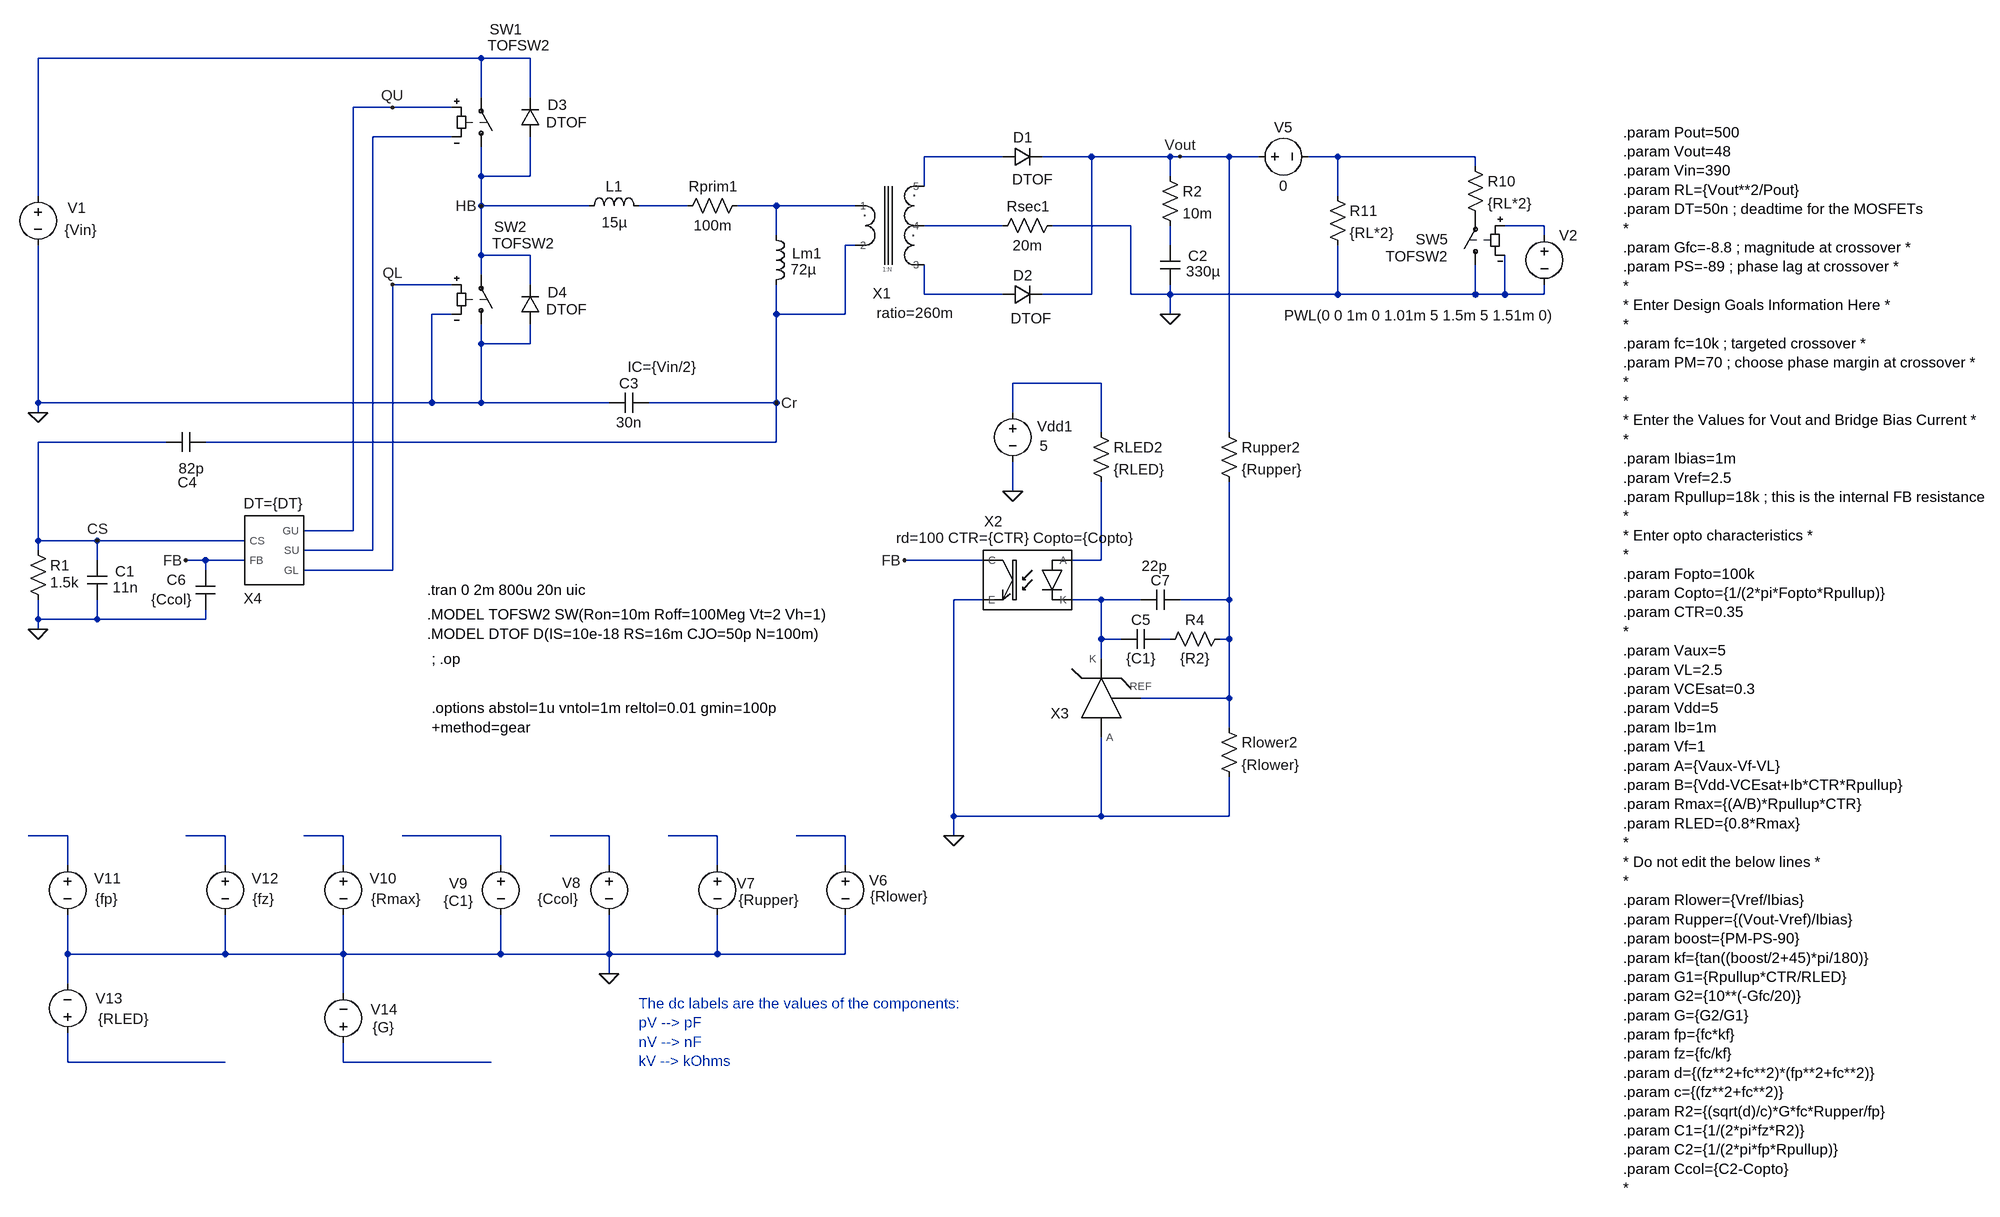
[diagram p0: schematic LLC CM - cbc - step load.asc]
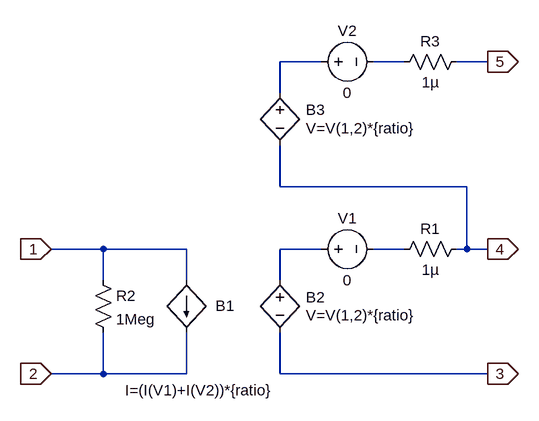
[diagram p1: sub-circuit xfmr_ctap.asc]
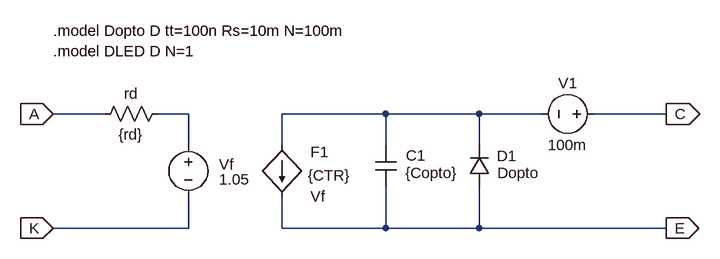
[diagram p2: sub-circuit optotof.asc]
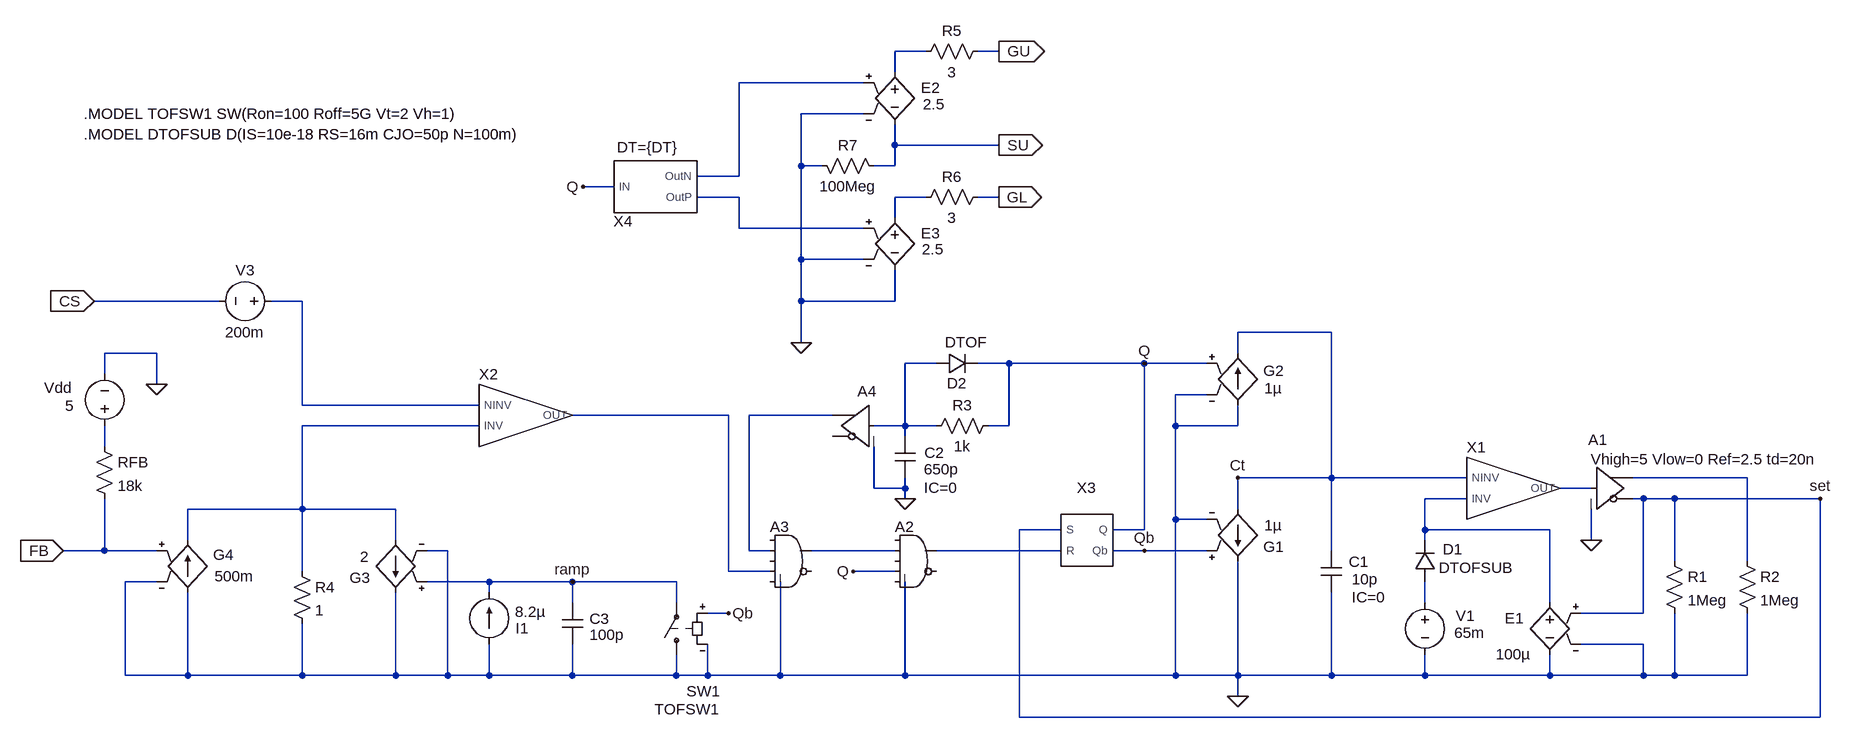
[diagram p3: sub-circuit cm_modulator_subckt.asc]
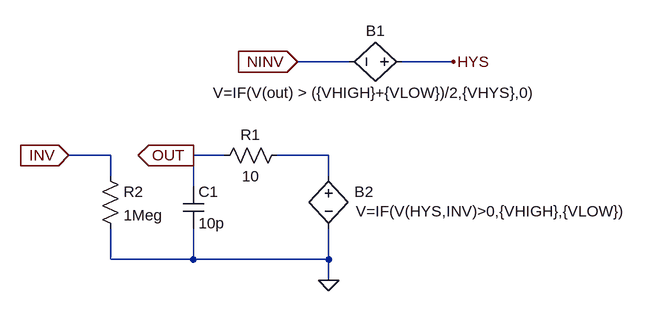
[diagram p4: sub-circuit comptof.asc]
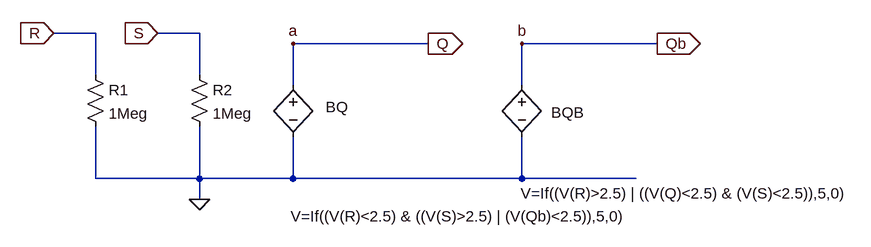
[diagram p5: sub-circuit sr_latch_llc.asc]
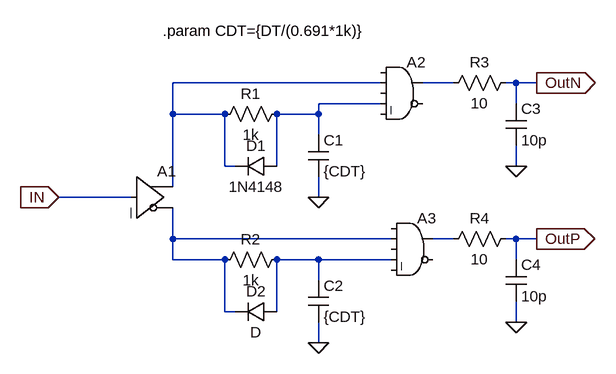
[diagram p6: sub-circuit dt_driver.asc]
LLC CM - cbc - step load.asc, the LTspice schematic file:
Version 4.1
SHEET 1 3320 1092
WIRE -1360 -1200 -2080 -1200
WIRE -1280 -1200 -1360 -1200
WIRE -1360 -1136 -1360 -1200
WIRE -1280 -1136 -1280 -1200
WIRE -1504 -1120 -1568 -1120
WIRE -1408 -1120 -1504 -1120
WIRE -1408 -1072 -1536 -1072
WIRE -512 -1040 -640 -1040
WIRE -368 -1040 -448 -1040
WIRE -240 -1040 -368 -1040
WIRE -224 -1040 -240 -1040
WIRE -144 -1040 -224 -1040
WIRE -96 -1040 -144 -1040
WIRE 32 -1040 -16 -1040
WIRE 256 -1040 32 -1040
WIRE 256 -1024 256 -1040
WIRE -1360 -1008 -1360 -1056
WIRE -1280 -1008 -1280 -1072
WIRE -1280 -1008 -1360 -1008
WIRE -240 -1008 -240 -1040
WIRE -640 -992 -640 -1040
WIRE -2080 -976 -2080 -1200
WIRE 32 -976 32 -1040
WIRE -1360 -960 -1360 -1008
WIRE -1184 -960 -1360 -960
WIRE -1024 -960 -1104 -960
WIRE -880 -960 -944 -960
WIRE -752 -960 -880 -960
WIRE -512 -928 -640 -928
WIRE -304 -928 -432 -928
WIRE 368 -928 304 -928
WIRE -880 -912 -880 -960
WIRE 368 -912 368 -928
WIRE -752 -896 -768 -896
WIRE -240 -896 -240 -928
WIRE -1360 -880 -1360 -960
WIRE -1280 -880 -1360 -880
WIRE -1360 -848 -1360 -880
WIRE -1408 -832 -1504 -832
WIRE -1280 -832 -1280 -880
WIRE -640 -816 -640 -864
WIRE -512 -816 -640 -816
WIRE -368 -816 -368 -1040
WIRE -368 -816 -448 -816
WIRE -304 -816 -304 -928
WIRE -240 -816 -240 -832
WIRE -240 -816 -304 -816
WIRE 32 -816 32 -896
WIRE 32 -816 -240 -816
WIRE 256 -816 256 -864
WIRE 256 -816 32 -816
WIRE 304 -816 304 -880
WIRE 304 -816 256 -816
WIRE 368 -816 368 -832
WIRE 368 -816 304 -816
WIRE -1408 -784 -1440 -784
WIRE -880 -784 -880 -832
WIRE -768 -784 -768 -896
WIRE -768 -784 -880 -784
WIRE -240 -784 -240 -816
WIRE -1360 -736 -1360 -768
WIRE -1280 -736 -1280 -768
WIRE -1280 -736 -1360 -736
WIRE -352 -672 -496 -672
WIRE -2080 -640 -2080 -896
WIRE -1440 -640 -1440 -784
WIRE -1440 -640 -2080 -640
WIRE -1360 -640 -1360 -736
WIRE -1360 -640 -1440 -640
WIRE -1152 -640 -1360 -640
WIRE -880 -640 -880 -784
WIRE -880 -640 -1088 -640
WIRE -2080 -624 -2080 -640
WIRE -496 -624 -496 -672
WIRE -352 -592 -352 -672
WIRE -144 -592 -144 -1040
WIRE -1872 -576 -2080 -576
WIRE -880 -576 -880 -640
WIRE -880 -576 -1808 -576
WIRE -496 -496 -496 -544
WIRE -1568 -432 -1568 -1120
WIRE -1568 -432 -1648 -432
WIRE -2080 -416 -2080 -576
WIRE -1984 -416 -2080 -416
WIRE -1744 -416 -1984 -416
WIRE -2080 -400 -2080 -416
WIRE -1536 -400 -1536 -1072
WIRE -1536 -400 -1648 -400
WIRE -1984 -384 -1984 -416
WIRE -1808 -384 -1840 -384
WIRE -1744 -384 -1808 -384
WIRE -544 -384 -672 -384
WIRE -352 -384 -352 -512
WIRE -352 -384 -400 -384
WIRE -1808 -368 -1808 -384
WIRE -1504 -368 -1504 -832
WIRE -1504 -368 -1648 -368
WIRE -544 -320 -592 -320
WIRE -352 -320 -400 -320
WIRE -288 -320 -352 -320
WIRE -144 -320 -144 -512
WIRE -144 -320 -224 -320
WIRE -2080 -288 -2080 -320
WIRE -1984 -288 -1984 -320
WIRE -1984 -288 -2080 -288
WIRE -1808 -288 -1808 -304
WIRE -1808 -288 -1984 -288
WIRE -2080 -272 -2080 -288
WIRE -352 -256 -352 -320
WIRE -320 -256 -352 -256
WIRE -240 -256 -256 -256
WIRE -144 -256 -144 -320
WIRE -144 -256 -160 -256
WIRE -352 -224 -352 -256
WIRE -144 -160 -144 -256
WIRE -144 -160 -288 -160
WIRE -144 -112 -144 -160
WIRE -592 32 -592 -320
WIRE -352 32 -352 -96
WIRE -352 32 -592 32
WIRE -144 32 -144 -32
WIRE -144 32 -352 32
WIRE -2032 64 -2096 64
WIRE -1776 64 -1840 64
WIRE -1584 64 -1648 64
WIRE -1328 64 -1488 64
WIRE -1152 64 -1248 64
WIRE -976 64 -1056 64
WIRE -768 64 -848 64
WIRE -592 64 -592 32
WIRE -2032 112 -2032 64
WIRE -1776 112 -1776 64
WIRE -1584 112 -1584 64
WIRE -1328 112 -1328 64
WIRE -1152 112 -1152 64
WIRE -976 112 -976 64
WIRE -768 112 -768 64
WIRE -2032 256 -2032 192
WIRE -1776 256 -1776 192
WIRE -1776 256 -2032 256
WIRE -1584 256 -1584 192
WIRE -1584 256 -1776 256
WIRE -1328 256 -1328 192
WIRE -1328 256 -1584 256
WIRE -1152 256 -1152 192
WIRE -1152 256 -1328 256
WIRE -976 256 -976 192
WIRE -976 256 -1152 256
WIRE -768 256 -768 192
WIRE -768 256 -976 256
WIRE -1152 288 -1152 256
WIRE -2032 304 -2032 256
WIRE -1584 320 -1584 256
WIRE -2032 432 -2032 384
WIRE -1776 432 -2032 432
WIRE -1584 432 -1584 400
WIRE -1344 432 -1584 432
FLAG -1152 288 0
FLAG -1840 -384 FB
FLAG -2080 -272 0
FLAG -240 -784 0
FLAG -224 -1040 Vout
FLAG -1360 -960 HB
FLAG -1504 -1120 QU
FLAG -1504 -832 QL
FLAG -880 -640 Cr
FLAG -2080 -624 0
FLAG -672 -384 FB
FLAG -592 64 0
FLAG -1984 -416 CS
FLAG -496 -496 0
DATAFLAG -2080 64 ""
DATAFLAG -1808 64 ""
DATAFLAG -1632 64 ""
DATAFLAG -1424 64 ""
DATAFLAG -1232 64 ""
DATAFLAG -1040 64 ""
DATAFLAG -848 64 ""
DATAFLAG -1840 432 ""
DATAFLAG -1440 432 ""
SYMBOL sw 256 -848 R180
WINDOW 3 45 30 Left 2
WINDOW 0 45 58 Left 2
SYMATTR Value TOFSW2
SYMATTR InstName SW5
SYMBOL res 240 -1040 R0
SYMATTR InstName R10
SYMATTR Value {RL*2}
SYMBOL res 16 -992 R0
SYMATTR InstName R11
SYMATTR Value {RL*2}
SYMBOL voltage 368 -928 R0
WINDOW 3 -423 146 Left 2
WINDOW 123 0 0 Left 0
WINDOW 39 0 0 Left 0
SYMATTR Value PWL(0 0 1m 0 1.01m 5 1.5m 5 1.51m 0)
SYMATTR InstName V2
SYMBOL voltage -112 -1040 R270
WINDOW 0 32 56 VTop 2
WINDOW 3 -32 56 VBottom 2
SYMATTR InstName V5
SYMATTR Value 0
SYMBOL voltage -768 96 R0
WINDOW 0 39 40 Left 2
WINDOW 3 40 66 Left 2
WINDOW 123 0 0 Left 0
WINDOW 39 0 0 Left 0
SYMATTR InstName V6
SYMATTR Value {Rlower}
SYMBOL voltage -976 96 R0
WINDOW 0 31 45 Left 2
WINDOW 3 35 72 Left 2
WINDOW 123 0 0 Left 0
WINDOW 39 0 0 Left 0
SYMATTR InstName V7
SYMATTR Value {Rupper}
SYMBOL voltage -1152 96 R0
WINDOW 0 -76 44 Left 2
WINDOW 3 -116 70 Left 2
SYMATTR InstName V8
SYMATTR Value {Ccol}
SYMBOL voltage -1328 96 R0
WINDOW 0 -84 45 Left 2
WINDOW 3 -93 73 Left 2
WINDOW 123 0 0 Left 0
WINDOW 39 0 0 Left 0
SYMATTR InstName V9
SYMATTR Value {C1}
SYMBOL voltage -1584 96 R0
WINDOW 0 43 37 Left 2
WINDOW 3 45 70 Left 2
WINDOW 123 0 0 Left 0
WINDOW 39 0 0 Left 0
SYMATTR InstName V10
SYMATTR Value {Rmax}
SYMBOL voltage -2032 96 R0
WINDOW 0 43 37 Left 2
WINDOW 3 45 70 Left 2
WINDOW 123 0 0 Left 0
WINDOW 39 0 0 Left 0
SYMATTR InstName V11
SYMATTR Value {fp}
SYMBOL voltage -1776 96 R0
WINDOW 0 43 37 Left 2
WINDOW 3 45 70 Left 2
WINDOW 123 0 0 Left 0
WINDOW 39 0 0 Left 0
SYMATTR InstName V12
SYMATTR Value {fz}
SYMBOL voltage -2032 400 M180
WINDOW 0 46 72 Left 2
WINDOW 3 50 39 Left 2
SYMATTR InstName V13
SYMATTR Value {RLED}
SYMBOL voltage -1584 416 R180
WINDOW 0 -87 70 Left 2
WINDOW 3 -83 41 Left 2
SYMATTR InstName V14
SYMATTR Value {G}
SYMBOL cap -2000 -384 R0
WINDOW 0 45 18 Left 2
WINDOW 3 41 44 Left 2
SYMATTR InstName C1
SYMATTR Value 11n
SYMBOL res -2096 -416 R0
WINDOW 3 36 68 Left 2
SYMATTR Value 1.5k
SYMATTR InstName R1
SYMBOL diode -512 -1024 R270
WINDOW 0 32 32 VTop 2
WINDOW 3 -5 48 VBottom 2
SYMATTR InstName D1
SYMATTR Value DTOF
SYMBOL diode -512 -800 R270
WINDOW 0 32 32 VTop 2
WINDOW 3 -7 46 VBottom 2
SYMATTR InstName D2
SYMATTR Value DTOF
SYMBOL res -256 -1024 R0
SYMATTR InstName R2
SYMATTR Value 10m
SYMBOL cap -256 -896 R0
WINDOW 0 45 17 Left 2
WINDOW 3 42 42 Left 2
SYMATTR InstName C2
SYMATTR Value 330µ
SYMBOL res -416 -944 R90
WINDOW 0 0 56 VBottom 2
WINDOW 3 32 56 VTop 2
SYMATTR InstName Rsec1
SYMATTR Value 20m
SYMBOL ind -896 -928 R0
WINDOW 0 42 45 Left 2
WINDOW 3 39 71 Left 2
SYMATTR InstName Lm1
SYMATTR Value 72µ
SYMBOL cap -1088 -656 R90
WINDOW 0 0 32 VBottom 2
WINDOW 3 32 32 VTop 2
WINDOW 123 -27 -21 VBottom 2
SYMATTR InstName C3
SYMATTR Value 30n
SYMATTR Value2 IC={Vin/2}
SYMBOL res -928 -976 R90
WINDOW 0 0 56 VBottom 2
WINDOW 3 32 56 VTop 2
SYMATTR InstName Rprim1
SYMATTR Value 100m
SYMBOL ind -1200 -944 R270
WINDOW 0 32 56 VTop 2
WINDOW 3 5 56 VBottom 2
SYMATTR InstName L1
SYMATTR Value 15µ
SYMBOL sw -1360 -1040 M180
WINDOW 3 11 181 Left 2
WINDOW 0 14 207 Left 2
SYMATTR Value TOFSW2
SYMATTR InstName SW1
SYMBOL sw -1360 -752 M180
WINDOW 3 18 147 Left 2
WINDOW 0 21 174 Left 2
SYMATTR Value TOFSW2
SYMATTR InstName SW2
SYMBOL voltage -2080 -992 R0
WINDOW 0 48 35 Left 2
WINDOW 3 43 71 Left 2
SYMATTR InstName V1
SYMATTR Value {Vin}
SYMBOL diode -1264 -1072 R180
WINDOW 0 -43 52 Left 2
WINDOW 3 -76 24 Left 2
SYMATTR InstName D3
SYMATTR Value DTOF
SYMBOL diode -1264 -768 R180
WINDOW 0 -43 52 Left 2
WINDOW 3 -76 24 Left 2
SYMATTR InstName D4
SYMATTR Value DTOF
SYMBOL cap -1808 -592 R90
WINDOW 0 97 30 VBottom 2
WINDOW 3 43 23 VTop 2
SYMATTR InstName C4
SYMATTR Value 82p
SYMBOL XFMR_CTap -688 -944 R0
WINDOW 0 -21 142 Bottom 2
WINDOW 39 32 173 Bottom 2
SYMATTR InstName X1
SYMATTR SpiceLine ratio=260m
SYMBOL res -160 -128 R0
SYMATTR InstName Rlower2
SYMATTR Value {Rlower}
SYMBOL res -160 -608 R0
SYMATTR InstName Rupper2
SYMATTR Value {Rupper}
SYMBOL res -368 -608 R0
SYMATTR InstName RLED2
SYMATTR Value {RLED}
SYMBOL cap -256 -272 R90
WINDOW 0 0 32 VBottom 2
WINDOW 3 32 32 VTop 2
SYMATTR InstName C5
SYMATTR Value {C1}
SYMBOL cap -1792 -368 M0
WINDOW 0 48 16 Left 2
WINDOW 3 40 47 Left 2
SYMATTR InstName C6
SYMATTR Value {Ccol}
SYMBOL res -144 -272 R90
WINDOW 0 0 56 VBottom 2
WINDOW 3 32 56 VTop 2
SYMATTR InstName R4
SYMATTR Value {R2}
SYMBOL cap -224 -336 R90
WINDOW 0 0 32 VBottom 2
WINDOW 3 -55 42 VTop 2
SYMATTR InstName C7
SYMATTR Value 22p
SYMBOL optoTOF -512 -352 M0
WINDOW 0 16 -80 Bottom 2
WINDOW 39 -16 -53 Bottom 2
SYMATTR InstName X2
SYMATTR SpiceLine rd=100 CTR={CTR} Copto={Copto}
SYMBOL TL431TOF -368 -208 R0
WINDOW 0 -52 88 Bottom 2
SYMATTR InstName X3
SYMBOL CM_modulator_subckt -1696 -400 R0
WINDOW 0 -35 93 Bottom 2
WINDOW 39 -2 -61 Bottom 2
SYMATTR InstName X4
SYMATTR SpiceLine DT={DT}
SYMBOL voltage -496 -640 R0
WINDOW 0 40 38 Left 2
WINDOW 3 44 70 Left 2
SYMATTR InstName Vdd1
SYMATTR Value 5
TEXT -1448 -336 Left 2 !.tran 0 2m 800u 20n uic
TEXT 496 -1080 Left 2 !.param Pout=500\n.param Vout=48\n.param Vin=390\n.param RL={Vout**2/Pout}\n.param DT=50n ; deadtime for the MOSFETs\n*\n.param Gfc=-8.8 ; magnitude at crossover *\n.param PS=-89 ; phase lag at crossover *\n*\n* Enter Design Goals Information Here *\n*\n.param fc=10k ; targeted crossover *\n.param PM=70 ; choose phase margin at crossover *\n*\n*\n* Enter the Values for Vout and Bridge Bias Current *\n*\n.param Ibias=1m\n.param Vref=2.5\n.param Rpullup=18k ; this is the internal FB resistance\n*\n* Enter opto characteristics *\n*\n.param Fopto=100k\n.param Copto={1/(2*pi*Fopto*Rpullup)}\n.param CTR=0.35\n*\n.param Vaux=5\n.param VL=2.5\n.param VCEsat=0.3\n.param Vdd=5\n.param Ib=1m\n.param Vf=1\n.param A={Vaux-Vf-VL}\n.param B={Vdd-VCEsat+Ib*CTR*Rpullup}\n.param Rmax={(A/B)*Rpullup*CTR}\n.param RLED={0.8*Rmax}\n*\n* Do not edit the below lines *\n*\n.param Rlower={Vref/Ibias}\n.param Rupper={(Vout-Vref)/Ibias}\n.param boost={PM-PS-90}\n.param kf={tan((boost/2+45)*pi/180)}\n.param G1={Rpullup*CTR/RLED}\n.param G2={10**(-Gfc/20)}\n.param G={G2/G1}\n.param fp={fc*kf}\n.param fz={fc/kf}\n.param d={(fz**2+fc**2)*(fp**2+fc**2)}\n.param c={(fz**2+fc**2)}\n.param R2={(sqrt(d)/c)*G*fc*Rupper/fp}\n.param C1={1/(2*pi*fz*R2)}\n.param C2={1/(2*pi*fp*Rpullup)}\n.param Ccol={C2-Copto}\n*
TEXT -1104 336 Left 2 ;The dc labels are the values of the components:\npV --> pF\nnV --> nF\nkV --> kOhms
TEXT -1448 -296 Left 2 !.MODEL TOFSW2 SW(Ron=10m Roff=100Meg Vt=2 Vh=1)\n.MODEL DTOF D(IS=10e-18 RS=16m CJO=50p N=100m)
TEXT -1440 -144 Left 2 !.options abstol=1u vntol=1m reltol=0.01 gmin=100p\n+method=gear
TEXT -1440 -224 Left 2 !; .op

xfmr_ctap.asc, the sub-circuit schematic file:
Version 4
SHEET 1 880 680
WIRE 368 -192 304 -192
WIRE 496 -192 448 -192
WIRE 624 -192 576 -192
WIRE 304 -144 304 -192
WIRE 304 0 304 -64
WIRE 592 0 304 0
WIRE 32 96 -48 96
WIRE 160 96 32 96
WIRE 368 96 304 96
WIRE 496 96 448 96
WIRE 592 96 592 0
WIRE 592 96 576 96
WIRE 624 96 592 96
WIRE 32 144 32 96
WIRE 160 144 160 96
WIRE 304 144 304 96
WIRE 32 288 32 224
WIRE 32 288 -48 288
WIRE 160 288 160 224
WIRE 160 288 32 288
WIRE 304 288 304 224
WIRE 624 288 304 288
FLAG 624 96 4
IOPIN 624 96 Out
FLAG 624 288 3
IOPIN 624 288 Out
FLAG -48 96 1
IOPIN -48 96 In
FLAG -48 288 2
IOPIN -48 288 In
FLAG 624 -192 5
IOPIN 624 -192 Out
SYMBOL bi 160 144 R0
WINDOW 0 45 39 Left 2
WINDOW 3 -94 169 Left 2
SYMATTR InstName B1
SYMATTR Value I=(I(V1)+I(V2))*{ratio}
SYMBOL bv 304 128 R0
WINDOW 0 40 42 Left 2
WINDOW 3 40 70 Left 2
SYMATTR InstName B2
SYMATTR Value V=V(1,2)*{ratio}
SYMBOL voltage 352 96 R270
WINDOW 0 32 56 VTop 2
WINDOW 3 -32 56 VBottom 2
WINDOW 123 0 0 Left 0
WINDOW 39 0 0 Left 0
SYMATTR InstName V1
SYMATTR Value 0
SYMBOL res 592 80 R90
WINDOW 0 0 56 VBottom 2
WINDOW 3 32 56 VTop 2
SYMATTR InstName R1
SYMATTR Value 1µ
SYMBOL res 16 128 R0
SYMATTR InstName R2
SYMATTR Value 1Meg
SYMBOL bv 304 -160 R0
WINDOW 0 40 42 Left 2
WINDOW 3 40 70 Left 2
SYMATTR InstName B3
SYMATTR Value V=V(1,2)*{ratio}
SYMBOL voltage 352 -192 R270
WINDOW 0 32 56 VTop 2
WINDOW 3 -32 56 VBottom 2
WINDOW 123 0 0 Left 0
WINDOW 39 0 0 Left 0
SYMATTR InstName V2
SYMATTR Value 0
SYMBOL res 592 -208 R90
WINDOW 0 0 56 VBottom 2
WINDOW 3 32 56 VTop 2
SYMATTR InstName R3
SYMATTR Value 1µ

optotof.asc, the sub-circuit schematic file:
Version 4
SHEET 1 892 680
WIRE -48 32 -128 32
WIRE 80 32 32 32
WIRE 384 32 224 32
WIRE 528 32 384 32
WIRE 624 32 528 32
WIRE 816 32 704 32
WIRE 80 80 80 32
WIRE 224 80 224 32
WIRE 384 80 384 32
WIRE 528 80 528 32
WIRE 80 208 80 160
WIRE 80 208 -128 208
WIRE 224 208 224 160
WIRE 384 208 384 144
WIRE 384 208 224 208
WIRE 528 208 528 144
WIRE 528 208 384 208
WIRE 816 208 528 208
FLAG -128 32 A
IOPIN -128 32 In
FLAG -128 208 K
IOPIN -128 208 In
FLAG 816 32 C
IOPIN 816 32 Out
FLAG 816 208 E
IOPIN 816 208 Out
SYMBOL f 224 80 R0
WINDOW 0 44 11 Left 2
WINDOW 3 40 47 Left 2
WINDOW 38 44 79 Left 2
SYMATTR InstName F1
SYMATTR Value {CTR}
SYMATTR SpiceModel Vf
SYMBOL res 48 16 R90
WINDOW 0 0 56 VBottom 2
WINDOW 3 32 56 VTop 2
SYMATTR InstName rd
SYMATTR Value {rd}
SYMBOL voltage 80 64 R0
WINDOW 0 47 46 Left 2
WINDOW 3 47 69 Left 2
WINDOW 123 0 0 Left 0
WINDOW 39 0 0 Left 0
SYMATTR InstName Vf
SYMATTR Value 1.05
SYMBOL voltage 720 32 R90
WINDOW 0 -32 56 VBottom 2
WINDOW 3 32 56 VTop 2
SYMATTR InstName V1
SYMATTR Value 100m
SYMBOL cap 368 80 R0
WINDOW 0 47 16 Left 2
WINDOW 3 46 43 Left 2
SYMATTR InstName C1
SYMATTR Value {Copto}
SYMBOL diode 512 144 M180
WINDOW 0 43 47 Left 2
WINDOW 3 44 21 Left 2
SYMATTR InstName D1
SYMATTR Value Dopto
TEXT -128 -96 Left 2 !.model Dopto D tt=100n Rs=10m N=100m\n.model DLED D N=1

cm_modulator_subckt.asc, the sub-circuit schematic file:
Version 4
SHEET 1 1496 680
WIRE 80 -576 32 -576
WIRE 192 -576 160 -576
WIRE 32 -544 32 -576
WIRE -16 -528 -208 -528
WIRE -16 -480 -112 -480
WIRE 32 -432 32 -464
WIRE 192 -432 32 -432
WIRE -112 -400 -112 -480
WIRE -80 -400 -112 -400
WIRE 32 -400 32 -432
WIRE 32 -400 0 -400
WIRE -208 -384 -208 -528
WIRE -208 -384 -272 -384
WIRE -400 -368 -448 -368
WIRE -208 -352 -272 -352
WIRE 80 -352 32 -352
WIRE 192 -352 160 -352
WIRE 32 -320 32 -352
WIRE -208 -304 -208 -352
WIRE -16 -304 -208 -304
WIRE -112 -256 -112 -400
WIRE -16 -256 -112 -256
WIRE -1008 -192 -1200 -192
WIRE -880 -192 -928 -192
WIRE -112 -192 -112 -256
WIRE 32 -192 32 -240
WIRE 32 -192 -112 -192
WIRE 704 -144 560 -144
WIRE -112 -128 -112 -192
WIRE -1104 -112 -1184 -112
WIRE 560 -112 560 -144
WIRE 96 -96 48 -96
WIRE 208 -96 160 -96
WIRE 416 -96 208 -96
WIRE 512 -96 416 -96
WIRE -1184 -80 -1184 -112
WIRE -1104 -64 -1104 -112
WIRE 512 -48 464 -48
WIRE -880 -32 -880 -192
WIRE -608 -32 -880 -32
WIRE -224 -16 -464 -16
WIRE -64 -16 -192 -16
WIRE -608 0 -880 0
WIRE 48 0 48 -96
WIRE 48 0 0 0
WIRE 96 0 48 0
WIRE 208 0 208 -96
WIRE 208 0 176 0
WIRE 464 0 464 -48
WIRE 560 0 560 -32
WIRE 560 0 464 0
WIRE 48 16 48 0
WIRE -1184 32 -1184 0
WIRE 704 80 704 -144
WIRE 704 80 560 80
WIRE 912 80 704 80
WIRE 1344 80 1168 80
WIRE 0 96 0 32
WIRE 48 96 48 80
WIRE 48 96 0 96
WIRE 1104 96 1056 96
WIRE 48 112 48 96
WIRE 912 112 848 112
WIRE 1184 112 1168 112
WIRE 1232 112 1184 112
WIRE 1456 112 1232 112
WIRE -880 128 -880 0
WIRE -880 128 -1056 128
WIRE -736 128 -880 128
WIRE 560 128 560 80
WIRE 464 144 464 0
WIRE 512 144 464 144
WIRE 288 160 224 160
WIRE 416 160 416 -96
WIRE 416 160 368 160
WIRE 848 160 848 112
WIRE 1040 160 848 160
WIRE -1056 176 -1056 128
WIRE -736 176 -736 128
WIRE 848 176 848 160
WIRE 1104 176 1104 128
WIRE -1184 192 -1184 112
WIRE -1184 192 -1248 192
WIRE -1104 192 -1184 192
WIRE -656 192 -688 192
WIRE -192 192 -192 -16
WIRE -160 192 -192 192
WIRE 32 192 -96 192
WIRE 288 192 96 192
WIRE 416 192 368 192
WIRE 512 192 416 192
WIRE 704 192 704 80
WIRE 1232 208 1232 112
WIRE 1344 208 1344 80
WIRE -880 224 -880 128
WIRE -224 224 -224 -16
WIRE -160 224 -224 224
WIRE 32 224 -32 224
WIRE -1104 240 -1152 240
WIRE -592 240 -688 240
WIRE -464 240 -592 240
WIRE -304 240 -464 240
WIRE -592 256 -592 240
WIRE -464 272 -464 240
WIRE -304 272 -304 240
WIRE 848 272 848 240
WIRE 1040 272 1040 160
WIRE -224 288 -256 288
WIRE 1184 288 1184 112
WIRE 1184 288 1088 288
WIRE 1184 336 1088 336
WIRE -1152 384 -1152 240
WIRE -1056 384 -1056 256
WIRE -1056 384 -1152 384
WIRE -880 384 -880 304
WIRE -880 384 -1056 384
WIRE -736 384 -736 256
WIRE -736 384 -880 384
WIRE -656 384 -656 192
WIRE -656 384 -736 384
WIRE -592 384 -592 336
WIRE -592 384 -656 384
WIRE -464 384 -464 336
WIRE -464 384 -592 384
WIRE -304 384 -304 352
WIRE -304 384 -464 384
WIRE -256 384 -256 336
WIRE -256 384 -304 384
WIRE -144 384 -144 240
WIRE -144 384 -256 384
WIRE 48 384 48 240
WIRE 48 384 -144 384
WIRE 464 384 464 144
WIRE 464 384 48 384
WIRE 560 384 560 208
WIRE 560 384 464 384
WIRE 704 384 704 256
WIRE 704 384 560 384
WIRE 848 384 848 352
WIRE 848 384 704 384
WIRE 1040 384 1040 352
WIRE 1040 384 848 384
WIRE 1184 384 1184 336
WIRE 1184 384 1040 384
WIRE 1232 384 1232 288
WIRE 1232 384 1184 384
WIRE 1344 384 1344 288
WIRE 1344 384 1232 384
WIRE 560 416 560 384
WIRE 224 448 224 160
WIRE 1456 448 1456 112
WIRE 1456 448 224 448
FLAG 560 416 0
FLAG 560 80 Ct
FLAG 416 -96 Q
FLAG 1456 112 set
FLAG -32 224 Q
FLAG 48 112 0
FLAG 1104 176 0
FLAG 416 192 Qb
FLAG -224 288 Qb
FLAG -1248 192 FB
IOPIN -1248 192 In
FLAG -464 240 ramp
FLAG -1200 -192 CS
IOPIN -1200 -192 In
FLAG -1104 -64 0
FLAG -448 -368 Q
FLAG -112 -128 0
FLAG 192 -432 SU
IOPIN 192 -432 Out
FLAG 192 -576 GU
IOPIN 192 -576 Out
FLAG 192 -352 GL
IOPIN 192 -352 Out
SYMBOL cap 688 192 R0
WINDOW 0 43 17 Left 2
WINDOW 3 47 44 Left 2
WINDOW 123 47 72 Left 2
SYMATTR InstName C1
SYMATTR Value 10p
SYMATTR Value2 IC=0
SYMBOL g 560 224 M180
WINDOW 0 39 38 Left 2
WINDOW 3 41 71 Left 2
SYMATTR InstName G1
SYMATTR Value 1µ
SYMBOL g 560 -128 R0
WINDOW 0 39 43 Left 2
WINDOW 3 41 70 Left 2
SYMATTR InstName G2
SYMATTR Value 1µ
SYMBOL COMPTOF 976 96 M180
WINDOW 0 -49 79 Bottom 2
SYMATTR InstName X1
SYMATTR SpiceLine VHIGH=5 VLOW=100m VHYS=1u
SYMBOL voltage 848 256 R0
WINDOW 0 47 36 Left 2
WINDOW 3 45 62 Left 2
WINDOW 123 0 0 Left 0
WINDOW 39 0 0 Left 0
SYMATTR InstName V1
SYMATTR Value 65m
SYMBOL diode 864 240 R180
WINDOW 0 -42 50 Left 2
WINDOW 3 -120 22 Left 2
SYMATTR InstName D1
SYMATTR Value DTOFSUB
SYMBOL e 1040 256 M0
WINDOW 0 40 40 Left 2
WINDOW 3 29 95 Left 2
SYMATTR InstName E1
SYMATTR Value 100µ
SYMBOL Digital\\buf 1104 32 R0
WINDOW 0 -5 -11 Left 2
WINDOW 39 -1 19 Left 2
SYMATTR InstName A1
SYMATTR SpiceLine Vhigh=5 Vlow=0 Ref=2.5 td=20n
SYMBOL res 1216 192 R0
SYMATTR InstName R1
SYMATTR Value 1Meg
SYMBOL res 1328 192 R0
SYMATTR InstName R2
SYMATTR Value 1Meg
SYMBOL Digital\\and 64 144 R0
WINDOW 0 -32 11 Left 2
SYMATTR InstName A2
SYMATTR SpiceLine Vhigh=5 Vlow=0 Ref=2.5
SYMBOL Digital\\and -128 144 R0
WINDOW 0 -32 11 Left 2
SYMATTR InstName A3
SYMATTR SpiceLine Vhigh=5 Vlow=0 Ref=2.5
SYMBOL Digital\\buf 0 -64 M0
WINDOW 0 -4 11 Left 2
SYMATTR InstName A4
SYMATTR SpiceLine Vhigh=5 Vlow=0 Ref=2.5
SYMBOL res 192 -16 R90
WINDOW 0 0 56 VBottom 2
WINDOW 3 32 56 VTop 2
SYMATTR InstName R3
SYMATTR Value 1k
SYMBOL cap 32 16 R0
WINDOW 0 46 25 Left 2
WINDOW 3 45 51 Left 2
WINDOW 123 45 79 Left 2
SYMATTR InstName C2
SYMATTR Value 650p
SYMATTR Value2 IC=0
SYMBOL diode 96 -80 R270
WINDOW 0 -30 32 VTop 2
WINDOW 3 64 46 VBottom 2
SYMATTR InstName D2
SYMATTR Value DTOF
SYMBOL COMPTOF -544 -16 M180
WINDOW 0 -49 79 Bottom 2
SYMATTR InstName X2
SYMATTR SpiceLine VHIGH=5 VLOW=100m VHYS=100m
SYMBOL sw -304 368 R180
WINDOW 3 -67 -68 Left 2
WINDOW 0 -67 -40 Left 2
SYMATTR Value TOFSW1
SYMATTR InstName SW1
SYMBOL current -592 336 R180
WINDOW 0 -61 25 Left 2
WINDOW 3 -87 50 Left 2
WINDOW 123 0 0 Left 0
WINDOW 39 0 0 Left 0
SYMATTR InstName I1
SYMATTR Value 8.2µ
SYMBOL cap -480 272 R0
WINDOW 0 42 25 Left 2
WINDOW 3 42 49 Left 2
SYMATTR InstName C3
SYMATTR Value 100p
SYMBOL g -736 272 R180
WINDOW 0 39 38 Left 2
WINDOW 3 41 71 Left 2
SYMATTR InstName G3
SYMATTR Value 2
SYMBOL res -896 208 R0
SYMATTR InstName R4
SYMATTR Value 1
SYMBOL g -1056 160 R0
WINDOW 0 39 38 Left 2
WINDOW 3 41 71 Left 2
SYMATTR InstName G4
SYMATTR Value 500m
SYMBOL voltage -912 -192 R90
WINDOW 0 -32 56 VBottom 2
WINDOW 3 32 56 VTop 2
SYMATTR InstName V3
SYMATTR Value 200m
SYMBOL SR_latch_LLC 320 176 R0
SYMATTR InstName X3
SYMBOL res -1200 16 R0
SYMATTR InstName RFB
SYMATTR Value 18k
SYMBOL voltage -1184 16 R180
WINDOW 0 50 75 Left 2
WINDOW 3 47 47 Left 2
SYMATTR InstName Vdd
SYMATTR Value 5
SYMBOL DT_driver -336 -368 R0
WINDOW 39 -12 -45 Bottom 2
WINDOW 0 -50 69 Bottom 2
SYMATTR SpiceLine DT={DT}
SYMATTR InstName X4
SYMBOL e 32 -560 R0
WINDOW 0 40 40 Left 2
WINDOW 3 43 65 Left 2
SYMATTR InstName E2
SYMATTR Value 2.5
SYMBOL e 32 -336 R0
WINDOW 0 40 40 Left 2
WINDOW 3 42 64 Left 2
SYMATTR InstName E3
SYMATTR Value 2.5
SYMBOL res 176 -592 R90
WINDOW 0 0 56 VBottom 2
WINDOW 3 32 56 VTop 2
SYMATTR InstName R5
SYMATTR Value 3
SYMBOL res 176 -368 R90
WINDOW 0 0 56 VBottom 2
WINDOW 3 32 56 VTop 2
SYMATTR InstName R6
SYMATTR Value 3
SYMBOL res -96 -416 M90
WINDOW 0 0 56 VBottom 2
WINDOW 3 32 56 VTop 2
SYMATTR InstName R7
SYMATTR Value 100Meg
TEXT -1216 -480 Left 2 !.MODEL TOFSW1 SW(Ron=100 Roff=5G Vt=2 Vh=1)\n.MODEL DTOFSUB D(IS=10e-18 RS=16m CJO=50p N=100m)

comptof.asc, the sub-circuit schematic file:
Version 4
SHEET 1 880 680
WIRE 64 192 -16 192
WIRE 224 192 144 192
WIRE -304 336 -368 336
WIRE -128 336 -176 336
WIRE 32 336 -48 336
WIRE -304 368 -304 336
WIRE 32 368 32 336
WIRE -176 384 -176 336
WIRE -304 496 -304 448
WIRE -176 496 -176 448
WIRE -176 496 -304 496
WIRE 32 496 32 448
WIRE 32 496 -176 496
WIRE 32 528 32 496
FLAG -16 192 NINV
IOPIN -16 192 In
FLAG 224 192 HYS
FLAG 32 528 0
FLAG -176 336 OUT
IOPIN -176 336 Out
FLAG -368 336 INV
IOPIN -368 336 In
SYMBOL bv 160 192 R90
WINDOW 0 -32 56 VBottom 2
WINDOW 3 32 56 VTop 2
SYMATTR InstName B1
SYMATTR Value V=IF(V(out) > ({VHIGH}+{VLOW})/2,{VHYS},0)
SYMBOL bv 32 352 R0
WINDOW 0 40 40 Left 2
WINDOW 3 42 70 Left 2
SYMATTR InstName B2
SYMATTR Value V=IF(V(HYS,INV)>0,{VHIGH},{VLOW})
SYMBOL res -32 320 R90
WINDOW 0 0 56 VBottom 2
WINDOW 3 32 56 VTop 2
SYMATTR InstName R1
SYMATTR Value 10
SYMBOL cap -192 384 R0
SYMATTR InstName C1
SYMATTR Value 10p
SYMBOL res -320 352 R0
SYMATTR InstName R2
SYMATTR Value 1Meg

sr_latch_llc.asc, the sub-circuit schematic file:
Version 4
SHEET 1 1112 680
WIRE -192 48 -256 48
WIRE -32 48 -96 48
WIRE 320 64 112 64
WIRE 672 64 464 64
WIRE -192 112 -192 48
WIRE -32 112 -32 48
WIRE 112 128 112 64
WIRE 464 128 464 64
WIRE -192 272 -192 192
WIRE -32 272 -32 192
WIRE -32 272 -192 272
WIRE 112 272 112 208
WIRE 112 272 -32 272
WIRE 464 272 464 208
WIRE 464 272 112 272
WIRE 640 272 464 272
WIRE -32 304 -32 272
FLAG -256 48 R
IOPIN -256 48 In
FLAG -96 48 S
IOPIN -96 48 In
FLAG 320 64 Q
IOPIN 320 64 Out
FLAG -32 304 0
FLAG 672 64 Qb
IOPIN 672 64 Out
FLAG 112 64 a
FLAG 464 64 b
SYMBOL bv 112 112 R0
WINDOW 0 50 50 Left 2
WINDOW 3 -4 218 Left 2
SYMATTR InstName BQ
SYMATTR Value V=If((V(R)<2.5) & ((V(S)>2.5) | (V(Qb)<2.5)),5,0)
SYMBOL res -208 96 R0
SYMATTR InstName R1
SYMATTR Value 1Meg
SYMBOL res -48 96 R0
SYMATTR InstName R2
SYMATTR Value 1Meg
SYMBOL bv 464 112 R0
WINDOW 0 45 58 Left 2
WINDOW 3 -2 183 Left 2
SYMATTR InstName BQB
SYMATTR Value V=If((V(R)>2.5) | ((V(Q)<2.5) & (V(S)<2.5)),5,0)

dt_driver.asc, the sub-circuit schematic file:
Version 4
SHEET 1 880 680
WIRE 480 32 160 32
WIRE 592 32 544 32
WIRE 688 32 672 32
WIRE 720 32 688 32
WIRE 480 64 384 64
WIRE 688 64 688 32
WIRE 160 80 160 32
WIRE 240 80 160 80
WIRE 384 80 384 64
WIRE 384 80 320 80
WIRE 384 112 384 80
WIRE 240 160 240 80
WIRE 256 160 240 160
WIRE 320 160 320 80
WIRE 688 160 688 128
WIRE 160 192 160 80
WIRE 96 208 -16 208
WIRE 384 208 384 176
WIRE 160 272 160 224
WIRE 496 272 160 272
WIRE 592 272 560 272
WIRE 688 272 672 272
WIRE 720 272 688 272
WIRE 160 304 160 272
WIRE 240 304 160 304
WIRE 384 304 320 304
WIRE 496 304 384 304
WIRE 688 304 688 272
WIRE 384 336 384 304
WIRE 240 384 240 304
WIRE 256 384 240 384
WIRE 320 384 320 304
WIRE 688 400 688 368
WIRE 384 432 384 400
FLAG 384 208 0
FLAG 384 432 0
FLAG 720 32 OutN
IOPIN 720 32 Out
FLAG 720 272 OutP
IOPIN 720 272 Out
FLAG -16 208 IN
IOPIN -16 208 In
FLAG 688 160 0
FLAG 688 400 0
SYMBOL Digital\\buf 96 144 R0
SYMATTR InstName A1
SYMATTR SpiceLine Vhigh=5 Vlow=0 Ref=1.0
SYMBOL res 336 64 R90
WINDOW 0 0 56 VBottom 2
WINDOW 3 32 56 VTop 2
SYMATTR InstName R1
SYMATTR Value 1k
SYMBOL cap 368 112 R0
SYMATTR InstName C1
SYMATTR Value {CDT}
SYMBOL res 336 288 R90
WINDOW 0 0 56 VBottom 2
WINDOW 3 32 56 VTop 2
SYMATTR InstName R2
SYMATTR Value 1k
SYMBOL cap 368 336 R0
SYMATTR InstName C2
SYMATTR Value {CDT}
SYMBOL Digital\\and 512 -16 R0
SYMATTR InstName A2
SYMATTR SpiceLine Vhigh=5 Vlow=0 Ref=2.5
SYMBOL Digital\\and 528 224 R0
SYMATTR InstName A3
SYMATTR SpiceLine Vhigh=5 Vlow=0 Ref=2.5
SYMBOL diode 320 144 R90
WINDOW 0 0 32 VBottom 2
WINDOW 3 32 32 VTop 2
SYMATTR InstName D1
SYMATTR Value 1N4148
SYMBOL diode 320 368 R90
WINDOW 0 0 32 VBottom 2
WINDOW 3 32 32 VTop 2
SYMATTR InstName D2
SYMBOL res 688 16 R90
WINDOW 0 0 56 VBottom 2
WINDOW 3 32 56 VTop 2
SYMATTR InstName R3
SYMATTR Value 10
SYMBOL res 688 256 R90
WINDOW 0 0 56 VBottom 2
WINDOW 3 32 56 VTop 2
SYMATTR InstName R4
SYMATTR Value 10
SYMBOL cap 672 64 R0
SYMATTR InstName C3
SYMATTR Value 10p
SYMBOL cap 672 304 R0
SYMATTR InstName C4
SYMATTR Value 10p
TEXT 144 -48 Left 2 !.param CDT={DT/(0.691*1k)}

The netlist it stands for:
* LLC CM - cbc - step load.asc
SW5 0 P001 N008 0 TOFSW2
R10 N004 P001 {RL*2}
R11 N004 0 {RL*2}
V2 N008 0 PWL(0 0 1m 0 1.01m 5 1.5m 5 1.51m 0)
V5 Vout N004 0
V6 N022 0 {Rlower}
V7 N021 0 {Rupper}
V8 N020 0 {Ccol}
V9 N019 0 {C1}
V10 N018 0 {Rmax}
V11 N016 0 {fp}
V12 N017 0 {fz}
V13 N023 0 {RLED}
V14 N024 0 {G}
C1 CS 0 11n
R1 CS 0 1.5k
D1 N003 Vout DTOF
D2 N010 Vout DTOF
R2 Vout N009 10m
C2 N009 0 330µ
Rsec1 0 N007 20m
Lm1 N006 Cr 72µ
C3 Cr 0 30n IC={Vin/2}
Rprim1 N006 N005 100m
L1 HB N005 15µ
SW1 HB N001 QU N002 TOFSW2
SW2 0 HB QL 0 TOFSW2
V1 N001 0 {Vin}
D3 HB N001 DTOF
D4 0 HB DTOF
C4 Cr CS 82p
X§X1 N006 Cr N010 N007 N003 xfmr_ctap params: ratio=260m
Rlower2 N014 0 {Rlower}
Rupper2 Vout N014 {Rupper}
RLED2 N011 N012 {RLED}
C5 N015 N013 {C1}
C6 FB 0 {Ccol}
R4 N014 N015 {R2}
C7 N014 N013 22p
X§X2 N012 N013 FB 0 optotof params: rd=100 CTR={CTR} Copto={Copto}
X§X3 0 N014 N013 TL431TOF  ; pins A REF K
X§X4 CS FB QL QU N002 cm_modulator_subckt params: DT={DT}
Vdd1 N011 0 5

* block symbol definitions
.subckt xfmr_ctap 1 2 3 4 5
B1 1 2 I=(I(V1)+I(V2))*{ratio}
B2 N003 3 V=V(1,2)*{ratio}
V1 N003 N004 0
R1 4 N004 1µ
R2 1 2 1Meg
B3 N001 4 V=V(1,2)*{ratio}
V2 N001 N002 0
R3 5 N002 1µ
.ends xfmr_ctap

.subckt optotof A K C E
F1 N002 E Vf {CTR}
rd N001 A {rd}
Vf N001 K 1.05
V1 C N002 100m
C1 N002 E {Copto}
D1 E N002 Dopto
.model Dopto D tt=100n Rs=10m N=100m
.model DLED D N=1
.ends optotof

.subckt cm_modulator_subckt CS FB GL GU SU
C1 Ct 0 10p IC=0
G1 Ct 0 Qb 0 1µ
G2 0 Ct Q 0 1µ
XX1 N013 Ct N012 comptof params: VHIGH=5 VLOW=100m VHYS=1u
V1 N016 0 65m
D1 N016 N013 DTOFSUB
E1 N013 0 set 0 100µ
A1 N012 0 0 0 0 set N011 0 BUF Vhigh=5 Vlow=0 Ref=2.5 td=20n
R1 set 0 1Meg
R2 N011 0 1Meg
A2 0 N014 0 Q 0 0 N015 0 AND Vhigh=5 Vlow=0 Ref=2.5
A3 0 N008 0 N007 0 0 N014 0 AND Vhigh=5 Vlow=0 Ref=2.5
A4 N006 0 0 0 0 0 N008 0 BUF Vhigh=5 Vlow=0 Ref=2.5
R3 Q N006 1k
C2 N006 0 650p IC=0
D2 N006 Q DTOF
XX2 N009 N005 N007 comptof params: VHIGH=5 VLOW=100m VHYS=100m
SW1 0 ramp Qb 0 TOFSW1
I1 0 ramp 8.2µ
C3 ramp 0 100p
G3 N009 0 ramp 0 2
R4 N009 0 1
G4 0 N009 FB 0 500m
V3 N005 CS 200m
XX3 N015 set Q Qb sr_latch_llc
RFB N010 FB 18k
Vdd N010 0 5
XX4 Q N002 N003 dt_driver params: DT={DT}
E2 N001 SU N002 0 2.5
E3 N004 0 N003 0 2.5
R5 GU N001 3
R6 GL N004 3
R7 0 SU 100Meg
.MODEL TOFSW1 SW(Ron=100 Roff=5G Vt=2 Vh=1)
.MODEL DTOFSUB D(IS=10e-18 RS=16m CJO=50p N=100m)
.ends cm_modulator_subckt

.subckt comptof INV NINV OUT
B1 HYS NINV V=IF(V(out) > ({VHIGH}+{VLOW})/2,{VHYS},0)
B2 N001 0 V=IF(V(HYS,INV)>0,{VHIGH},{VLOW})
R1 N001 OUT 10
C1 OUT 0 10p
R2 INV 0 1Meg
.ends comptof

.subckt sr_latch_llc R S Q Qb
BQ Q 0 V=If((V(R)<2.5) & ((V(S)>2.5) | (V(Qb)<2.5)),5,0)
R1 R 0 1Meg
R2 S 0 1Meg
BQB Qb 0 V=If((V(R)>2.5) | ((V(Q)<2.5) & (V(S)<2.5)),5,0)
.ends sr_latch_llc

.subckt dt_driver IN OutN OutP
A1 IN 0 0 0 0 N004 N001 0 BUF Vhigh=5 Vlow=0 Ref=1.0
R1 N003 N001 1k
C1 N003 0 {CDT}
R2 N006 N004 1k
C2 N006 0 {CDT}
A2 0 N001 0 N003 0 0 N002 0 AND Vhigh=5 Vlow=0 Ref=2.5
A3 0 N004 0 N006 0 0 N005 0 AND Vhigh=5 Vlow=0 Ref=2.5
D1 N003 N001 1N4148
D2 N006 N004 D
R3 OutN N002 10
R4 OutP N005 10
C3 OutN 0 10p
C4 OutP 0 10p
.param CDT={DT/(0.691*1k)}
.ends dt_driver

.model D D
.lib standard.dio
.tran 0 2m 800u 20n uic
.param Pout=500
.param Vout=48
.param Vin=390
.param RL={Vout**2/Pout}
.param DT=50n ; deadtime for the MOSFETs
*
.param Gfc=-8.8 ; magnitude at crossover *
.param PS=-89 ; phase lag at crossover *
*
* Enter Design Goals Information Here *
*
.param fc=10k ; targeted crossover *
.param PM=70 ; choose phase margin at crossover *
*
*
* Enter the Values for Vout and Bridge Bias Current *
*
.param Ibias=1m
.param Vref=2.5
.param Rpullup=18k ; this is the internal FB resistance
*
* Enter opto characteristics *
*
.param Fopto=100k
.param Copto={1/(2*pi*Fopto*Rpullup)}
.param CTR=0.35
*
.param Vaux=5
.param VL=2.5
.param VCEsat=0.3
.param Vdd=5
.param Ib=1m
.param Vf=1
.param A={Vaux-Vf-VL}
.param B={Vdd-VCEsat+Ib*CTR*Rpullup}
.param Rmax={(A/B)*Rpullup*CTR}
.param RLED={0.8*Rmax}
*
* Do not edit the below lines *
*
.param Rlower={Vref/Ibias}
.param Rupper={(Vout-Vref)/Ibias}
.param boost={PM-PS-90}
.param kf={tan((boost/2+45)*pi/180)}
.param G1={Rpullup*CTR/RLED}
.param G2={10**(-Gfc/20)}
.param G={G2/G1}
.param fp={fc*kf}
.param fz={fc/kf}
.param d={(fz**2+fc**2)*(fp**2+fc**2)}
.param c={(fz**2+fc**2)}
.param R2={(sqrt(d)/c)*G*fc*Rupper/fp}
.param C1={1/(2*pi*fz*R2)}
.param C2={1/(2*pi*fp*Rpullup)}
.param Ccol={C2-Copto}
*
* The dc labels are the values of the components:
* pV --> pF
* nV --> nF
* kV --> kOhms
.MODEL TOFSW2 SW(Ron=10m Roff=100Meg Vt=2 Vh=1)
.MODEL DTOF D(IS=10e-18 RS=16m CJO=50p N=100m)
.options abstol=1u vntol=1m reltol=0.01 gmin=100p
+method=gear
; .op
.backanno
.end